# EasyEDA Pro project lab442canpowerV2.epro

# Schematic Schematic1
Board Name: Board1; Create Date: 2025-07-20; Page Name: P1; Project Name: New Project_2025-07-20_13-36-06; Schematic Name: Schematic1; Update Date: 2025-08-07; Company: 嘉立创EDA; Page Size: A4; Version: V1.0
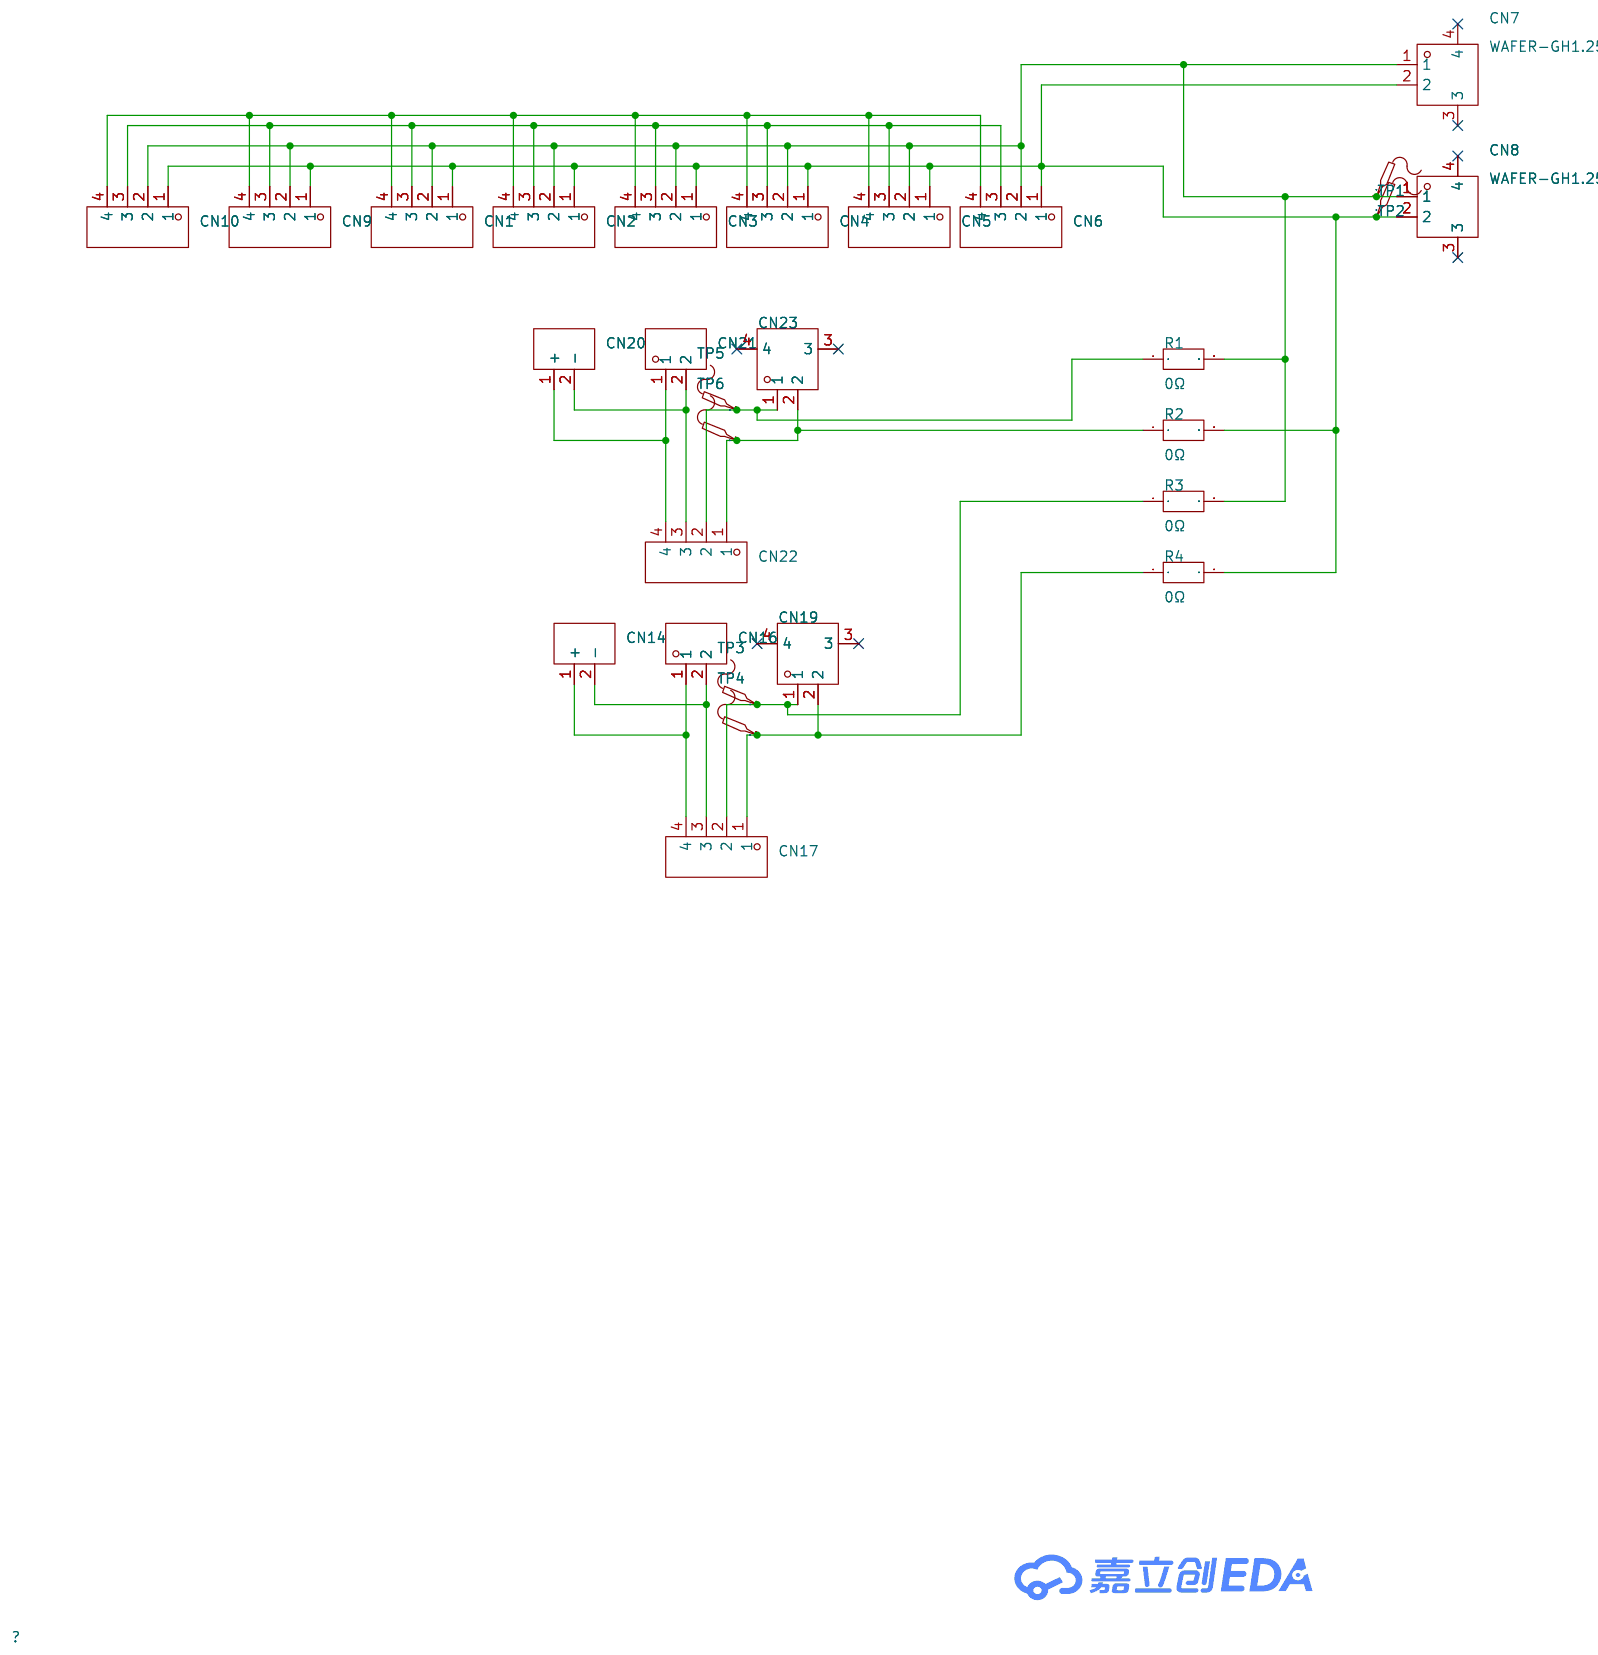
[diagram p0: schematic sheet]

## Parts
CN1  XT30(2+2)PB-M.G.B  [CONN-TH_XT30PB-M]
CN2  XT30(2+2)PB-M.G.B  [CONN-TH_XT30PB-M]
CN3  XT30(2+2)PB-M.G.B  [CONN-TH_XT30PB-M]
CN4  XT30(2+2)PB-M.G.B  [CONN-TH_XT30PB-M]
CN5  XT30(2+2)PB-M.G.B  [CONN-TH_XT30PB-M]
CN6  XT30(2+2)PB-M.G.B  [CONN-TH_XT30PB-M]
CN7  WAFER-GH1.25-2PWB  [CONN-TH_2P-P1.25_XUNPU_WAFER-GH1.25-2PWB]
CN8  WAFER-GH1.25-2PWB  [CONN-TH_2P-P1.25_XUNPU_WAFER-GH1.25-2PWB]
CN9  XT30(2+2)PB-M.G.B  [CONN-TH_XT30PB-M]
CN10  XT30(2+2)PB-M.G.B  [CONN-TH_XT30PB-M]
CN14  XT30UPB-F30.G.Y  [CONN-TH_XT30UPB-F]
CN16  XT30U-M  [CONN-TH_XT30U-M]
CN17  XT30(2+2)PB-M.G.B  [CONN-TH_XT30PB-M]
CN19  WAFER-GH1.25-2PWB  [CONN-TH_2P-P1.25_XUNPU_WAFER-GH1.25-2PWB]
CN20  XT30UPB-F30.G.Y  [CONN-TH_XT30UPB-F]
CN21  XT30U-M  [CONN-TH_XT30U-M]
CN22  XT30(2+2)PB-M.G.B  [CONN-TH_XT30PB-M]
CN23  WAFER-GH1.25-2PWB  [CONN-TH_2P-P1.25_XUNPU_WAFER-GH1.25-2PWB]
R1  0Ω  [RES-SMD_L6.4-W3.2-A]
R2  0Ω  [RES-SMD_L6.4-W3.2-A]
R3  0Ω  [RES-SMD_L6.4-W3.2-A]
R4  0Ω  [RES-SMD_L6.4-W3.2-A]
TP1  -  [Test-Point-0.5mm]
TP2  -  [Test-Point-0.5mm]
TP3  -  [Test-Point-0.5mm]
TP4  -  [Test-Point-0.5mm]
TP5  -  [Test-Point-0.5mm]
TP6  -  [Test-Point-0.5mm]

## Library data of the parts
CN1-CN6 CN9 CN10 CN17 CN22 = XT30(2+2)PB-M.G.B: LCSC Part Name: XT30PB(2+2)功率数据混合插头公金黑PCB直插; Supplier Part: C19268029; Manufacturer: AMASS(艾迈斯); JLCPCB Part Class: 扩展库; Datasheet: https://item.szlcsc.com/datasheet/XT30(2%252B2)PB-M.G.B/20526040.html; Supplier: LCSC
CN7 CN8 CN19 CN23 = WAFER-GH1.25-2PWB: 插针结构:1x2P;间距:1.25mm;安装方式:卧贴;参考系列:GH;总PIN数:2P;排数:1;每排PIN数:2;行距:-;额定电流:1A;触头材质:黄铜;触头镀层:-;工作温度范围:-25℃~+85℃;; LCSC Part Name: 1x2P 间距:1.25mm 卧贴 系列:GH; Supplier Part: C3029377; Manufacturer: XUNPU(讯普); Supplier Footprint: SMD,P=1.25mm,卧贴; JLCPCB Part Class: 扩展库; Datasheet: https://atta.szlcsc.com/upload/public/pdf/source/20220527/CB8773BFB0913C3B8ABD62CB38BA101A.pdf; Supplier: LCSC; Pins Structure: 1x2P; Pitch: 1.25mm; Mounting Type: 卧贴; Reference Series: GH; Number of Pins: 2P; Number of Rows: 1; Number of PINs Per Row: 2; Current Rating: 1A; Contact Material: 黄铜; Operating Temperature: -25℃~+85℃; Voltage Rating: 125V; Plastic Material: LCP; Supplementary Features: 辅助焊脚; Color: 米色; Z-Height of the Board: 4.35mm; X-Length of Bottom Edge on Board (Spacing Line): 5.75mm; Y-Width of Bottom Edge on Board: 5mm
CN14 CN20 = XT30UPB-F30.G.Y: 类别:-;类型1:-;; LCSC Part Name: AMASS(艾迈斯)直立焊板式连接器XT30UPB30-F.G.*; Supplier Part: C108769; Manufacturer: AMASS(艾迈斯); JLCPCB Part Class: 扩展库; Datasheet: https://item.szlcsc.com/datasheet/XT30UPB-F30.G.Y/109989.html; Supplier: LCSC; Type: 航模插头; Colour: 黄色; RatedVoltage: DC 500V; InterfaceType: 母头; MetalMaterial: 镀金; InsulationMaterial: PA; RatedCurrent: 15A; contact resistance: 0.65mΩ
CN16 CN21 = XT30U-M: 类别:-;类型1:-;; LCSC Part Name: AMASS(艾迈斯)轻量版锂电池插头公头 XT30U-M; Supplier Part: C99101; Manufacturer: AMASS(艾迈斯); JLCPCB Part Class: 扩展库; Datasheet: https://item.szlcsc.com/datasheet/XT30U-M/100314.html; Supplier: LCSC; Type: 插头; Colour: 黄色; InterfaceType: 公头
R1-R4 = RE2512F3R000L: 电阻类型:采样电阻;阻值:0Ω;精度:±1%;功率:3W;; LCSC Part Name: 0mΩ 3W 2512 ±1%; Supplier Part: C46961764; Manufacturer: 捷而瑞; Supplier Footprint: 2512; JLCPCB Part Class: 扩展库; Datasheet: https://atta.szlcsc.com/upload/public/pdf/source/20250325/401775B85EF7B3A580BC34DFED100CB2.pdf; Supplier: LCSC; Type: 采样电阻; Tolerance: ±1%; Power(Watts): 3W
TP1-TP6 = Test-Point: Test Point 测试点

## Nets
$1N410: CN1.4 CN2.4 CN3.4 CN4.4 CN5.4 CN6.4 CN9.4 CN10.4
$1N418: CN1.3 CN2.3 CN3.3 CN4.3 CN5.3 CN6.3 CN9.3 CN10.3
$1N424: CN1.2 CN2.2 CN3.2 CN4.2 CN5.2 CN6.2 CN7.1 CN8.1 CN9.2 CN10.2 R1.2 R3.2 TP1.1
$1N430: CN1.1 CN2.1 CN3.1 CN4.1 CN5.1 CN6.1 CN7.2 CN8.2 CN9.1 CN10.1 R2.2 R4.2 TP2.1
$1N2249: CN14.1(+) CN16.1 CN17.4
$1N2267: CN14.2(-) CN16.2 CN17.3
$1N2943: CN20.1(+) CN21.1 CN22.4
$1N2948: CN20.2(-) CN21.2 CN22.3
$1N3521: CN22.1 CN23.2 R2.1 TP6.1
$1N3525: CN22.2 CN23.1 R1.1 TP5.1
$1N3619: CN17.2 CN19.1 R3.1 TP3.1
$1N3628: CN17.1 CN19.2 R4.1 TP4.1

Not connected (* = marked no-connect by the designer): CN7 3* 4*; CN8 3* 4*; CN19 3* 4*; CN23 3* 4*

# Board PCB1
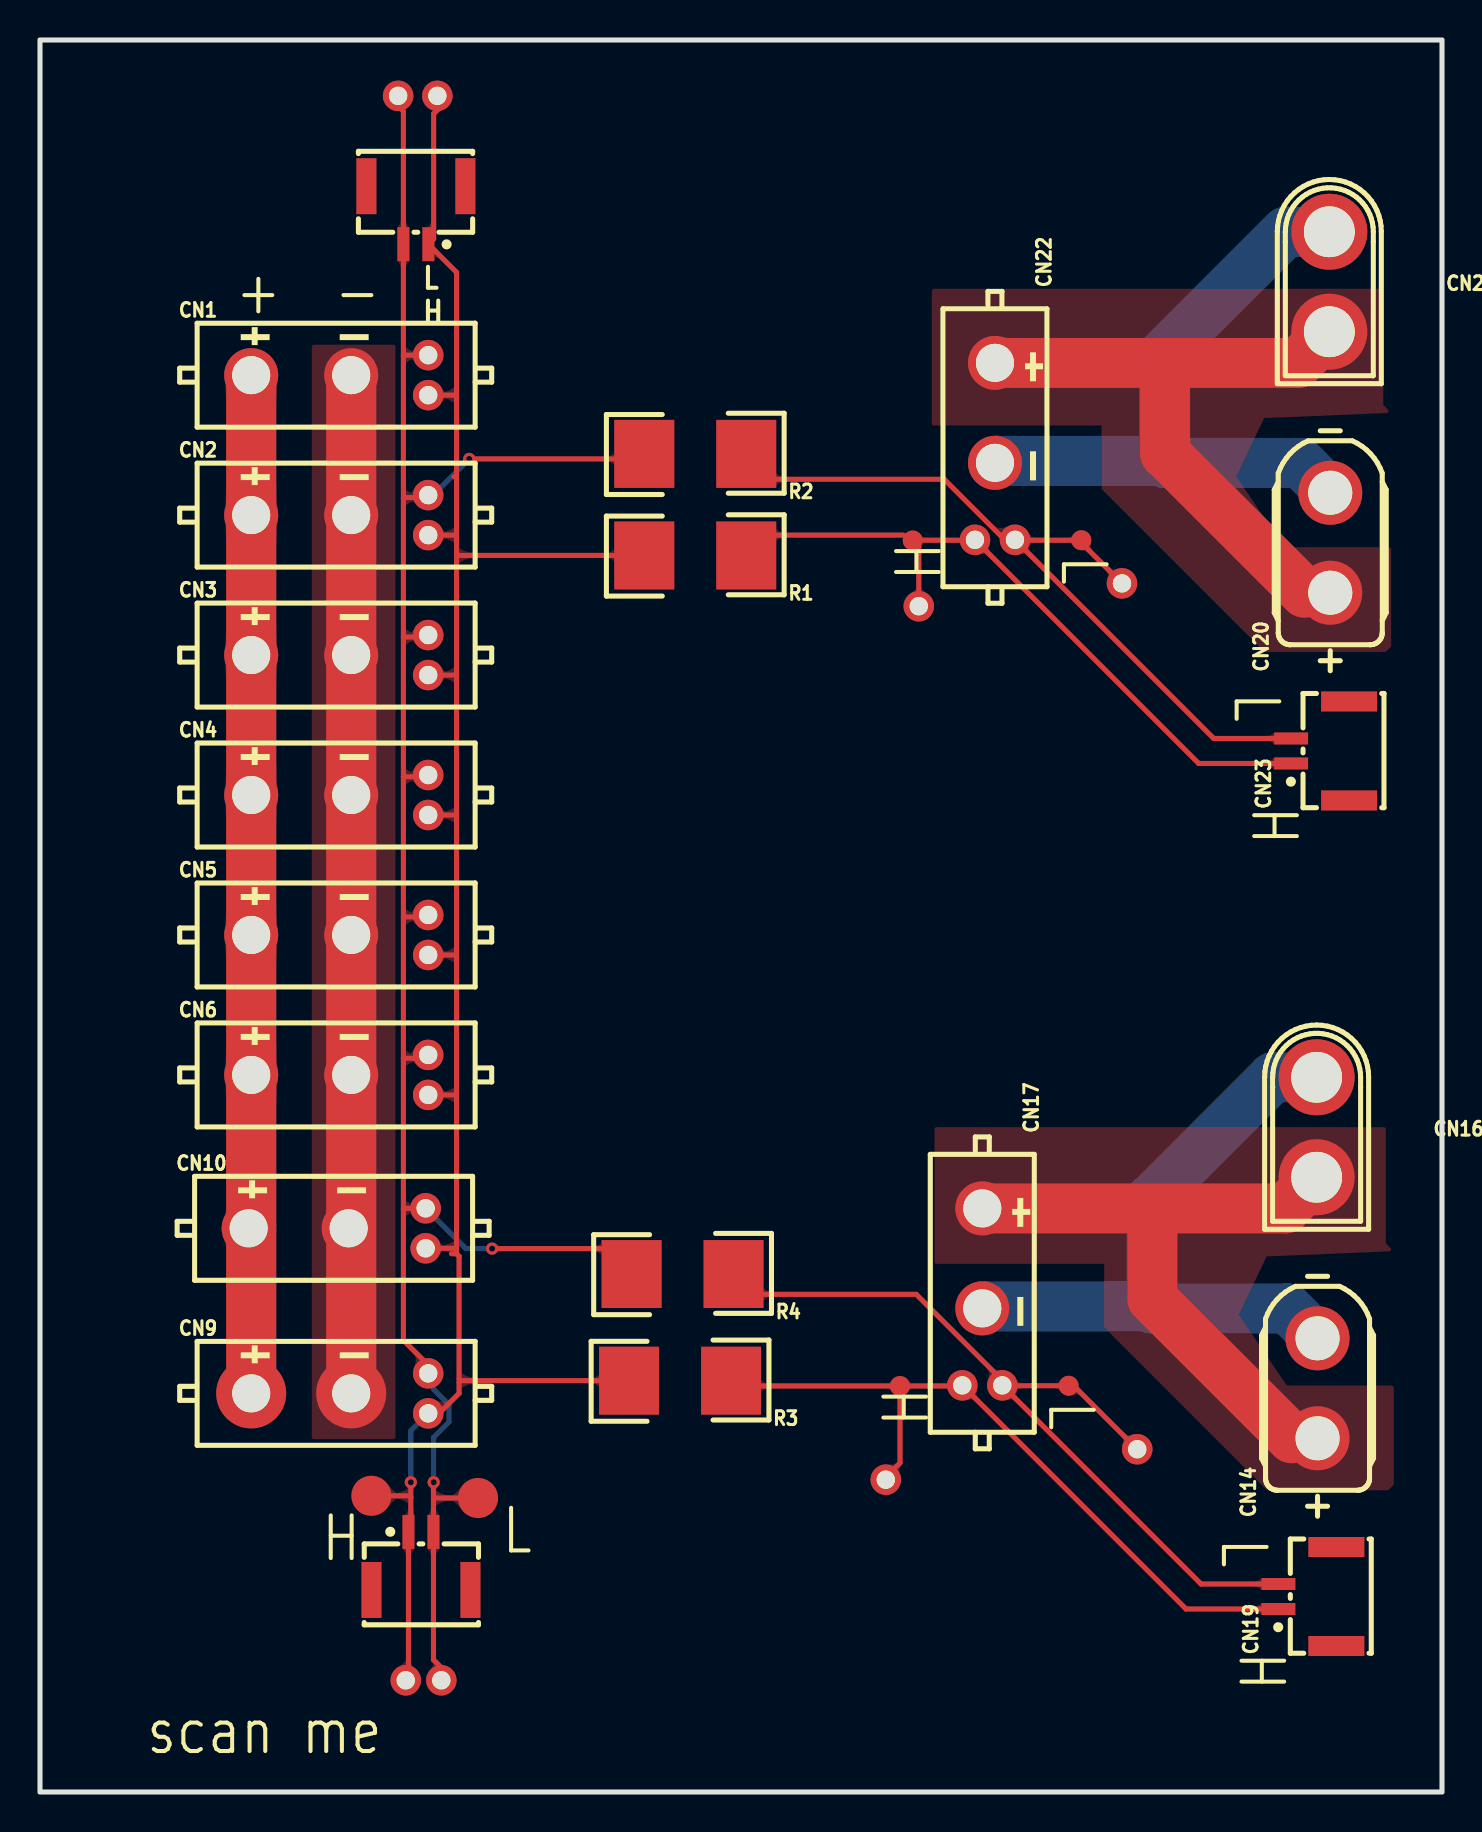
[diagram p1: board, top side]
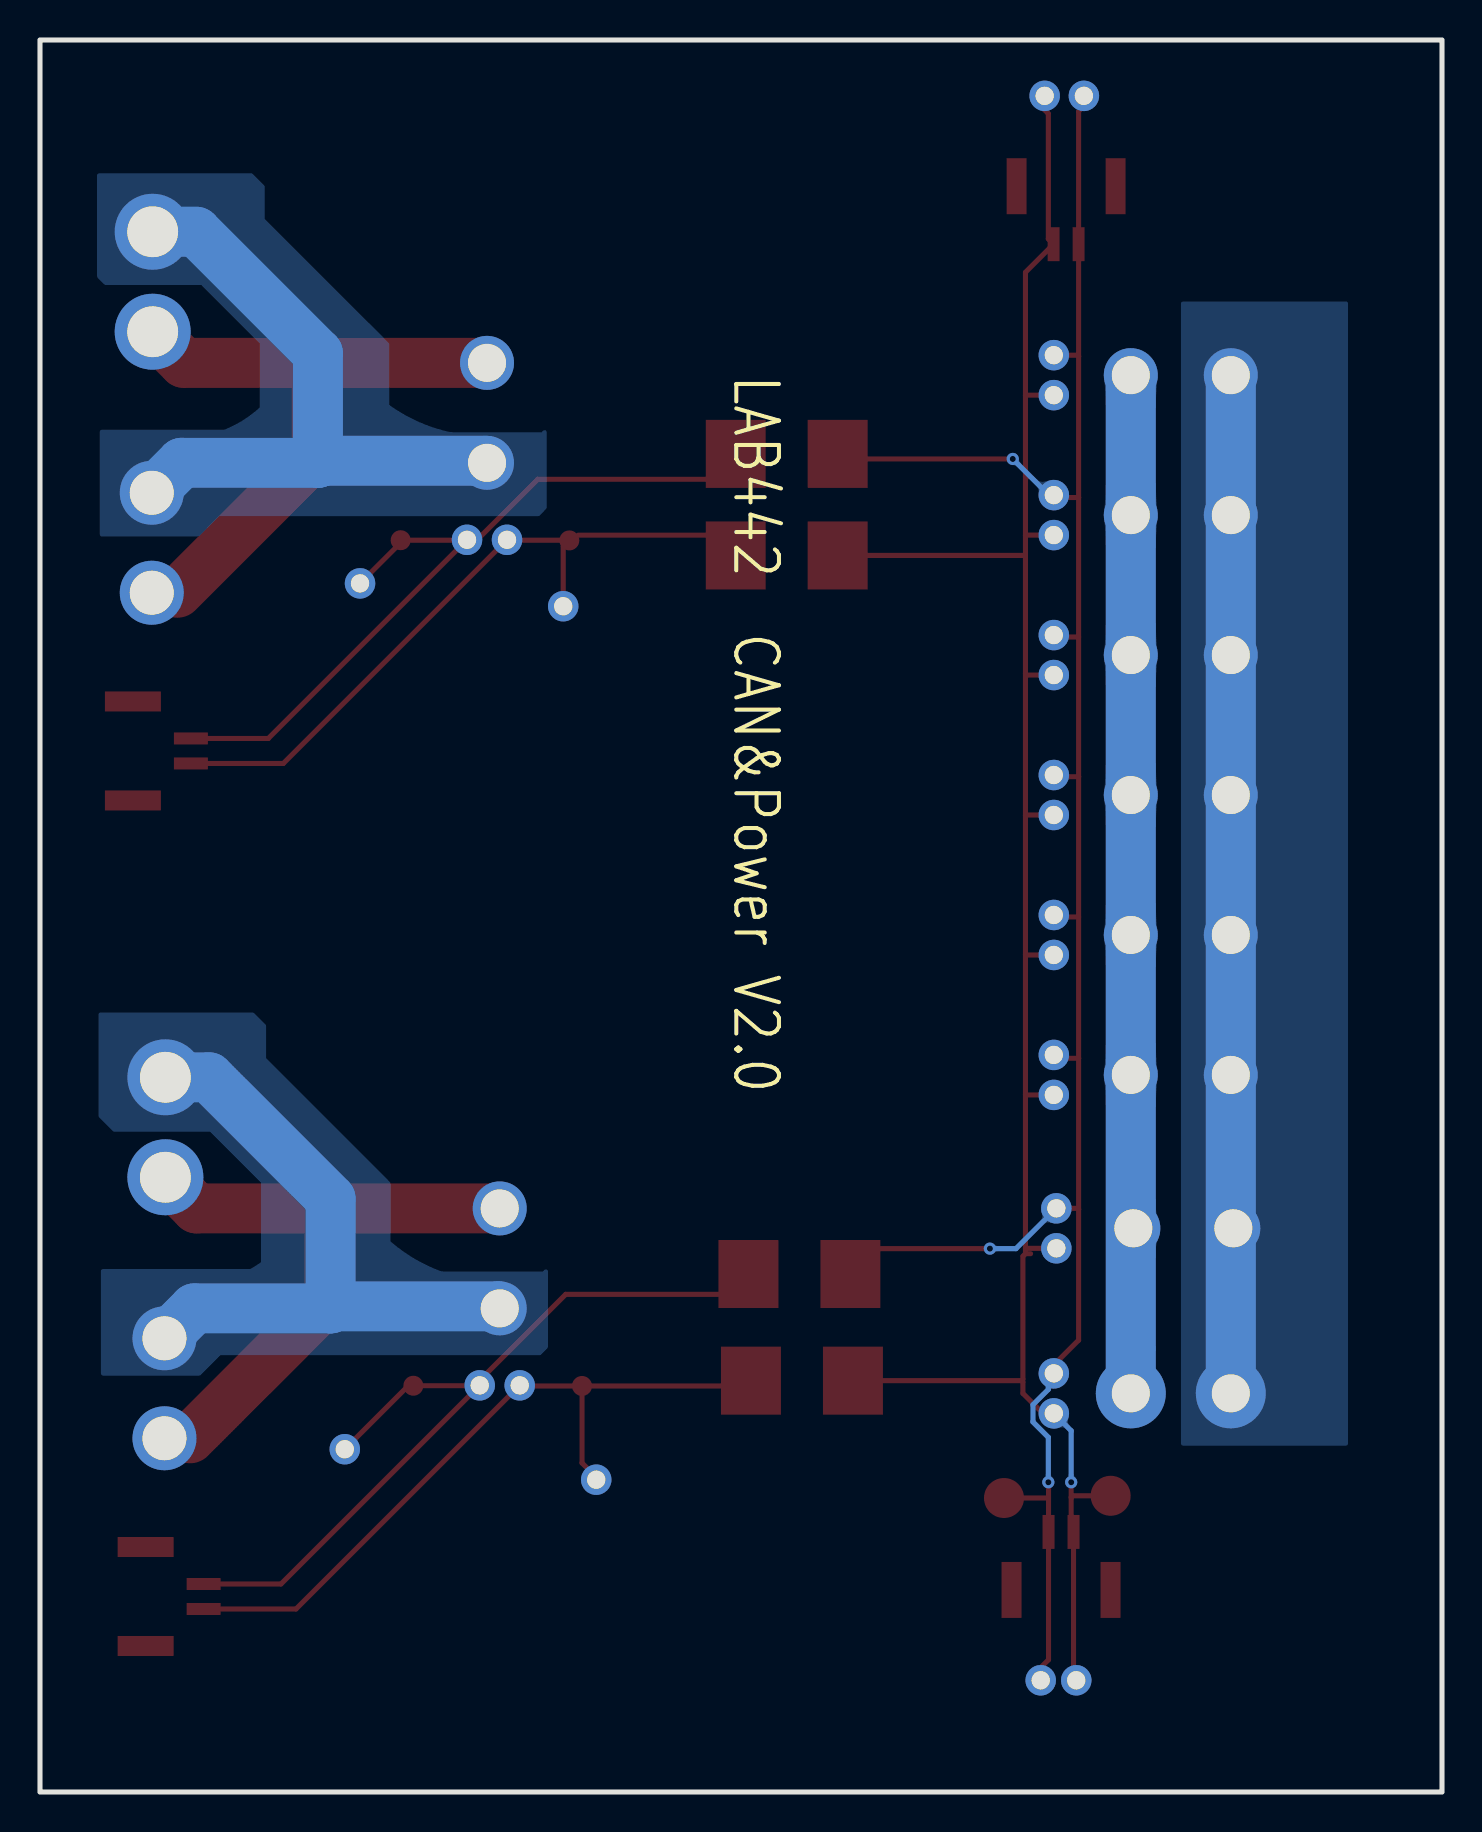
[diagram p2: board, bottom side, seen from below]

Outline 70.1 x 87.63 mm; copper layers: Top Layer, Bottom Layer. Coordinates in mm from the lower left corner of the outline.
Outline path: rectangle 0,87.63 70.1,0
Stack: Top Layer 0.035mm / Dielectric1 1.51mm FR4 er 4.5 / Bottom Layer 0.035mm

## Design rules (mm)
template: 自定义配置
spacing copperThickness1oz (default): track to track 0.102, other pairs 0.152 to 0.3
spacing copperThickness2oz: track to track 0.203, other pairs 0.152 to 0.3
track width copperThickness1oz (default): min 0.127, default 0.254, max 2.54
track width copperThickness2oz: min 0.203, default 0.254, max 2.54
differential pair differentialPair (default): width min 0.127, default 0.254, max 2.54; gap min 0.152, default 0.152
via viaSize (default): diameter min 0.5, default 0.61, max 10; hole min 0.3, default 0.305, max 6.3
pour e626 uses copperRegion
pour e762 uses copperRegion
pour e318 uses copperRegion
pour e321 uses copperRegion

## Placement (name value [footprint] x y rotation side)
CN1  XT30(2+2)PB-M.G.B  [CONN-TH_XT30PB-M]  14.99 70.87 0 top
CN2  XT30(2+2)PB-M.G.B  [CONN-TH_XT30PB-M]  14.99 63.87 0 top
CN3  XT30(2+2)PB-M.G.B  [CONN-TH_XT30PB-M]  14.99 56.87 0 top
CN4  XT30(2+2)PB-M.G.B  [CONN-TH_XT30PB-M]  14.99 49.87 0 top
CN5  XT30(2+2)PB-M.G.B  [CONN-TH_XT30PB-M]  14.99 42.87 0 top
CN6  XT30(2+2)PB-M.G.B  [CONN-TH_XT30PB-M]  14.99 35.87 0 top
CN7  WAFER-GH1.25-2PWB  [CONN-TH_2P-P1.25_XUNPU_WAFER-GH1.25-2PWB]  18.8 78.87 180 top
CN8  WAFER-GH1.25-2PWB  [CONN-TH_2P-P1.25_XUNPU_WAFER-GH1.25-2PWB]  19.05 11.56 0 top
CN9  XT30(2+2)PB-M.G.B  [CONN-TH_XT30PB-M#2]  14.99 19.94 0 top
CN10  XT30(2+2)PB-M.G.B  [CONN-TH_XT30PB-M]  14.86 28.19 0 top
CN14  XT30UPB-F30.G.Y  [CONN-TH_XT30UPB-F]  63.88 20.19 90 top
CN16  XT30U-M  [CONN-TH_XT30U-M]  63.83 33.25 90 top
CN17  XT30(2+2)PB-M.G.B  [CONN-TH_XT30PB-M]  47.12 24.77 270 top
CN19  WAFER-GH1.25-2PWB  [CONN-TH_2P-P1.25_XUNPU_WAFER-GH1.25-2PWB]  63.37 9.78 90 top
CN20  XT30UPB-F30.G.Y  [CONN-TH_XT30UPB-F]  64.52 62.48 90 top
CN21  XT30U-M  [CONN-TH_XT30U-M]  64.47 75.54 90 top
CN22  XT30(2+2)PB-M.G.B  [CONN-TH_XT30PB-M]  47.75 67.06 270 top
CN23  WAFER-GH1.25-2PWB  [CONN-TH_2P-P1.25_XUNPU_WAFER-GH1.25-2PWB]  64.01 52.07 90 top
NOREF  -  [Pad_e758]  20.07 5.59 0 top
NOREF#2  -  [Pad_e748]  54.1 60.45 0 top
NOREF#3  -  [Pad_e755]  54.86 17.14 0 top
NOREF#4  -  [Pad_e747]  43.94 59.31 0 top
NOREF#5  -  [Pad_e769]  17.91 84.84 0 top
NOREF#6  -  [Pad_e770]  19.87 84.84 0 top
NOREF#7  -  [Pad_e757]  18.29 5.59 0 top
NOREF#8  -  [Pad_e754]  42.29 15.62 0 top
R1  0Ω  [RES-SMD_L6.4-W3.2-A]  32.77 61.85 180 top
R2  0Ω  [RES-SMD_L6.4-W3.2-A]  32.77 66.93 180 top
R3  0Ω  [RES-SMD_L6.4-W3.2-A]  32 20.57 180 top
R4  0Ω  [RES-SMD_L6.4-W3.2-A]  32.13 25.91 180 top
TP1  -  [Test-Point-0.5mm#2]  16.57 14.82 0 top
TP2  -  [Test-Point-0.5mm#2]  21.9 14.7 0 top
TP3  -  [Test-Point-0.5mm]  43 20.31 0 top
TP4  -  [Test-Point-0.5mm]  51.44 20.32 0 top
TP5  -  [Test-Point-0.5mm]  43.64 62.6 0 top
TP6  -  [Test-Point-0.5mm]  52.07 62.61 0 top

## Footprints (pads in the part's own frame, mm; a bottom-side part is the same pattern mirrored in y, then rotated)
CONN-TH_2P-P1.25_XUNPU_WAFER-GH1.25-2PWB
  rect 0.6x1.7 smd: 1(-0.625,1.45) 2(0.625,1.45)
  rect 1x2.8 smd: 3(-2.475,-1.45) 4(2.475,-1.45)
CONN-TH_XT30PB-M
  round 1.524 hole 0.914: 1(4.425,1) 2(4.425,-1)
  round 2.7 hole 1.9: 3(0.575,0) 4(-4.425,0)
CONN-TH_XT30PB-M#2
  round 1.524 hole 0.914: 1(4.425,1) 2(4.425,-1)
  round 3.5 hole 1.9: 3(0.575,0) 4(-4.425,0)
CONN-TH_XT30U-M
  round 3.8 hole 2.54: 1(-2.5,0) 2(2.5,0)
CONN-TH_XT30UPB-F
  round 3.2 hole 2.2: 1(-2.5,0) 2(2.5,0)
Pad_e747
  round 1.524 hole 0.914: 1(0,0)
Pad_e748
  round 1.524 hole 0.914: 2(0,0)
Pad_e754
  round 1.524 hole 0.914: 1(0,0)
Pad_e755
  round 1.524 hole 0.914: 2(0,0)
Pad_e757
  round 1.524 hole 0.914: 1(0,0)
Pad_e758
  round 1.524 hole 0.914: 2(0,0)
Pad_e769
  round 1.524 hole 0.914: 1(0,0)
Pad_e770
  round 1.524 hole 0.914: 2(0,0)
RES-SMD_L6.4-W3.2-A
  rect 3x3.4 smd: 1(-2.55,0) 2(2.55,0)
Test-Point-0.5mm
  round 1 smd: 1(0,0)
Test-Point-0.5mm#2
  round 2 smd: 1(0,0)

## Nets
$1N410: CN1.4 CN2.4 CN3.4 CN4.4 CN5.4 CN6.4 CN9.4 CN10.4
$1N418: CN1.3 CN2.3 CN3.3 CN4.3 CN5.3 CN6.3 CN9.3 CN10.3
$1N424: CN1.2 CN2.2 CN3.2 CN4.2 CN5.2 CN6.2 CN7.1 CN8.1 CN9.2 CN10.2 NOREF#6.2 NOREF#7.1 R1.2 R3.2 TP1.1
$1N430: CN1.1 CN2.1 CN3.1 CN4.1 CN5.1 CN6.1 CN7.2 CN8.2 CN9.1 CN10.1 NOREF.2 NOREF#5.1 R2.2 R4.2 TP2.1
$1N2249: CN14.1 CN16.1 CN17.4
$1N2267: CN14.2 CN16.2 CN17.3
$1N2943: CN20.1 CN21.1 CN22.4
$1N2948: CN20.2 CN21.2 CN22.3
$1N3521: CN22.1 CN23.2 NOREF#2.2 R2.1 TP6.1
$1N3525: CN22.2 CN23.1 NOREF#4.1 R1.1 TP5.1
$1N3619: CN17.2 CN19.1 NOREF#8.1 R3.1 TP3.1
$1N3628: CN17.1 CN19.2 NOREF#3.2 R4.1 TP4.1

Pads without a net: CN7 3 4; CN8 3 4; CN19 3 4; CN23 3 4

## Via types
v1: diameter 0.61, hole 0.305, Top Layer to Bottom Layer, 4 vias

## Routing (per net, layer and track width the routed paths; a pad name or vN(x,y) marks a point on that pad's centre or on a via; arc(x,y) is an arc through that point)
$1N410: length 102
  Top Layer w2.5: CN9.4 10.56,28.07 CN10.4 10.56,28.32 CN6.4 CN5.4 CN4.4 CN3.4 CN2.4 CN1.4
  Bottom Layer w2.5: CN1.4 CN2.4 CN3.4 CN4.4 CN5.4 CN6.4 CN9.4
$1N418: length 101.9
  Top Layer w2.5: CN1.3 CN2.3 CN3.3 CN4.3 CN5.3 CN6.3 CN9.3
  Bottom Layer w2.5: CN9.3 CN6.3 CN5.3 CN4.3 CN3.3 CN2.3 CN1.3
$1N424: length 111.9
  Top Layer w0.254: 20.83,61.91 20.83,55.93 ; 20.83,61.91 20.89,61.85 R1.2 ; 20.83,61.91 20.83,65.79 ; 20.83,55.93 20.76,55.87 CN3.2 ; 20.83,55.93 20.83,48.86 ; 20.83,26.92 20.57,26.92 ; 20.83,26.92 20.83,27.21 ; 20.83,26.92 20.95,26.8 20.95,20.65 21.03,20.57 ; 20.83,69.84 20.83,65.79 ; 20.83,69.84 20.83,76.01 19.42,77.42 19.69,77.68 19.69,83.95 19.87,84.13 NOREF#6.2 ; 20.83,69.84 20.8,69.87 CN1.2 ; 20.83,65.79 20.7,65.79 ; 18.54,14.74 18.46,14.82 TP1.1 ; 18.54,14.74 v1(18.54,15.49) ; 18.54,14.74 18.54,13.12 CN8.1 18.42,5.72 NOREF#7.1 ; 21.03,20.57 20.95,20.5 20.95,19.94 19.95,18.94 CN9.2 ; 21.03,20.57 R3.2 ; 20.83,34.9 20.83,27.21 ; 20.83,34.9 20.83,41.87 ; 20.83,34.9 20.8,34.87 CN6.2 ; 20.83,27.21 20.81,27.19 CN10.2 ; 20.83,48.86 20.83,41.87 ; 20.83,48.86 20.82,48.87 CN4.2 ; 20.83,41.87 20.82,41.87 CN5.2 ; CN2.2 20.83,62.87
  Bottom Layer w0.254: v1(18.54,15.49) 18.54,18.07 CN9.2
$1N430: length 116.2
  Top Layer w0.254: 18.17,29.14 18.22,29.19 CN10.1 ; 18.17,29.14 18.17,22.6 19.41,21.36 CN9.1 ; 18.17,29.14 18.17,36.7 ; v1(21.46,66.67) 29.96,66.67 R2.2 ; NOREF.2 20.07,6.22 19.67,6.61 CN8.2 19.67,14.7 ; 18.17,71.81 18.17,64.74 ; 18.17,71.81 18.22,71.87 CN1.1 ; 18.17,71.81 18.17,84.06 17.4,84.84 ; 18.17,64.74 18.17,57.77 ; 18.17,64.74 19.29,64.74 CN2.1 ; 19.67,14.7 19.68,14.7 TP2.1 22.31,15.11 ; 19.67,14.7 19.67,15.48 v1(19.69,15.49) ; 18.17,50.78 18.17,43.77 ; 18.17,50.78 19.32,50.78 CN4.1 ; 18.17,50.78 18.17,57.77 ; 18.17,43.77 19.31,43.77 CN5.1 ; 18.17,43.77 18.17,36.7 ; 18.17,57.77 19.32,57.77 CN3.1 ; 18.17,36.7 19.24,36.7 CN6.1 ; v1(22.61,27.18) 28.69,27.18 29.83,26.03
  Bottom Layer w0.254: v1(22.61,27.18) 21.3,27.18 CN10.1 ; CN9.1 19.69,20.66 19.69,20.14 20.45,19.37 20.45,18.51 19.69,17.74 v1(19.69,15.49) ; CN2.1 19.65,64.87 v1(21.46,66.67)
$1N2249: length 30.9
  Top Layer w2.5: CN17.4 62.28,29.19 CN16.1 ; 62.6,17.69 55.63,24.66 55.63,28.32
$1N2267: length 33.7
  Bottom Layer w2.5: 55.57,24.19 55.57,29.66 61.66,35.75 CN16.2 ; 55.57,24.19 62.38,24.19 CN14.2 ; 55.57,24.19 55.47,24.29 47.22,24.29 CN17.3
$1N2943: length 30.9
  Top Layer w2.5: CN21.1 62.91,71.48 CN22.4 ; 56.26,70.61 56.26,66.95 63.23,59.98
$1N2948: length 33.7
  Bottom Layer w2.5: CN22.3 47.85,66.58 56.11,66.58 56.21,66.48 ; 56.21,66.48 56.21,71.96 62.29,78.04 CN21.2 ; 56.21,66.48 63.02,66.48 CN20.2
$1N3521: length 39.4
  Top Layer w0.254: CN23.2 58.69,52.69 48.77,62.61 ; 48.77,62.61 TP6.1 52.07,62.48 NOREF#2.2 ; 48.77,62.61 CN22.1 48.24,62.63 45.21,65.66 36.59,65.66 R2.1
$1N3525: length 35.1
  Top Layer w0.254: TP5.1 43.94,62.29 NOREF#4.1 ; TP5.1 43.45,62.41 ; TP5.1 43.65,62.61 45.97,62.61 ; R1.1 35.32,62.37 35.81,62.86 43.18,62.86 ; CN23.1 57.94,51.44 CN22.2
$1N3619: length 36
  Top Layer w0.254: CN17.2 57.3,9.15 CN19.1 ; 42.42,15.88 43,16.46 TP3.1 ; TP3.1 35.33,20.31 34.68,20.95 ; TP3.1 45.34,20.31
$1N3628: length 40.3
  Top Layer w0.254: 34.94,26.03 36.08,24.89 43.81,24.89 47.75,20.95 ; 48.14,20.32 58.05,10.4 CN19.2 ; 48.14,20.32 TP4.1 51.69,20.32 54.48,17.53 ; 48.14,20.32 CN17.1

## Copper pours and planes (outline as drawn; the poured copper is in the pictures)
$1N410 on Bottom Layer: 4.7,74.55 13.05,74.55 13.05,17.32 4.7,17.32
$1N418 on Top Layer: 13.59,72.39 17.78,72.39 17.78,17.65 13.59,17.65
$1N2249 on Top Layer: 67.3,33.25 44.72,33.25 44.72,26.43 44.74,26.42 53.21,26.42 53.21,23.24 61.36,15.09 67.42,15.09 67.69,15.37 67.69,20.33 62.35,20.33 59.94,23.88 61.34,26.8 61.54,26.8 67.69,27.05 67.3,27.45
$1N2267 on Bottom Layer: 67.18,33.78 67.18,38.99 59.44,38.99 58.8,38.35 58.8,36.7 52.58,30.48 52.58,26.03 44.96,26.03 44.7,26.29 44.7,22.22 45.08,21.84 61.09,21.84 62.1,20.83 66.93,20.83 67.06,20.7 67.06,26.16 59.06,26.16 59.06,30.48 61.59,33.02 66.42,33.02
$1N2943 on Top Layer: 67.17,75.18 44.59,75.18 44.59,68.36 44.61,68.35 53.08,68.35 53.08,65.17 61.23,57.02 67.29,57.02 67.56,57.3 67.56,62.26 62.22,62.26 59.81,65.81 61.21,68.73 61.41,68.73 67.56,68.98 67.17,69.38
$1N2948 on Bottom Layer: 67.25,75.76 67.25,80.96 59.5,80.96 58.86,80.33 58.86,78.68 52.64,72.45 52.64,68.01 45.02,68.01 44.77,68.26 44.77,64.2 45.15,63.82 61.15,63.82 62.17,62.8 66.99,62.8 67.12,62.67 67.12,68.14 59.12,68.14 59.12,72.45 62.04,75.37 66.87,75.37

Small or netless copper shapes (teardrops, artwork), in the pictures only: 119 on Top Layer, 40 on Bottom Layer

## Text on the board
Bottom Silkscreen Layer: LAB442  CAN&Power V2.0
Top Silkscreen Layer: L / H | scan me | + | H | - | L
